# Altium project STM32F1_CNC_Project.PrjPcb
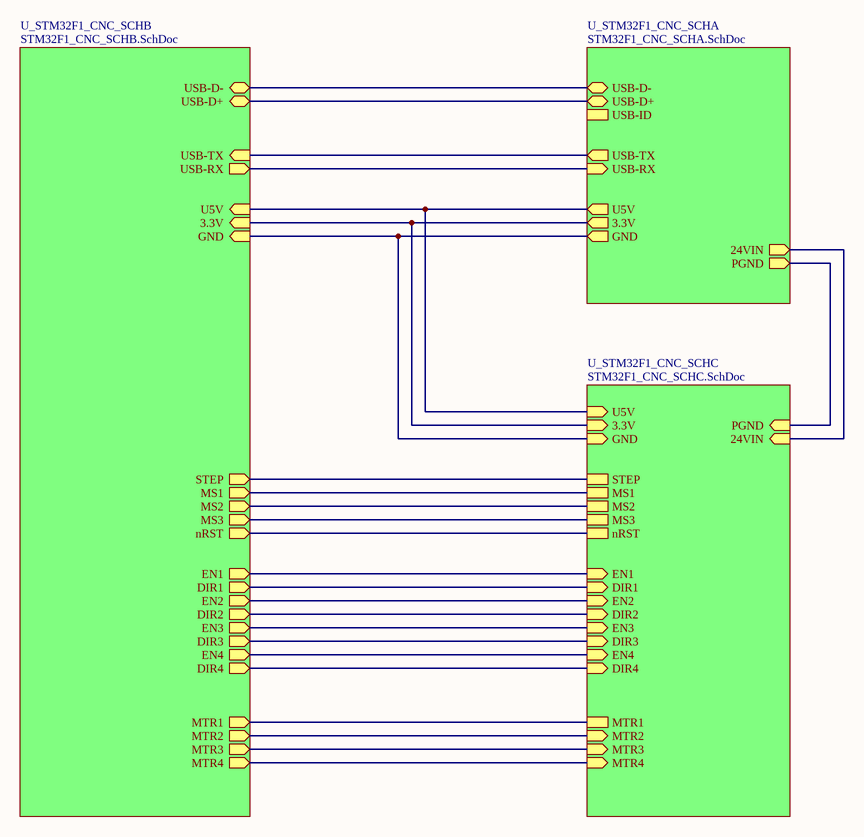
[diagram p0: STM32F1_CNC_SCH.SchDoc]
4 sheets, 120 parts. Net scope: hierarchical (ports join the sheet entries above them; power ports are global).
Board files: STM32F1_CNC_PCB.PcbDoc, CNC标志.PcbDoc
Sheets:
  STM32F1_CNC_SCH.SchDoc
    U_STM32F1_CNC_SCHA = STM32F1_CNC_SCHA.SchDoc
    U_STM32F1_CNC_SCHB = STM32F1_CNC_SCHB.SchDoc
    U_STM32F1_CNC_SCHC = STM32F1_CNC_SCHC.SchDoc

## Sheet STM32F1_CNC_SCH.SchDoc
size A4

### Sub-sheets
U_STM32F1_CNC_SCHA = STM32F1_CNC_SCHA.SchDoc: 24VIN (out), PGND (out), U5V (out), GND (out), USB-D- (bidir), USB-D+ (bidir), USB-ID, USB-TX (out), USB-RX (in), 3.3V (out)
U_STM32F1_CNC_SCHB = STM32F1_CNC_SCHB.SchDoc: GND (in), USB-D- (bidir), USB-D+ (bidir), USB-TX (in), USB-RX (out), 3.3V (in), U5V (in), STEP (out), MS1 (out), MS2 (out), MS3 (out), nRST (out), EN1 (out), DIR1 (out), EN2 (out), DIR2 (out), EN3 (out), DIR3 (out), EN4 (out), DIR4 (out), MTR1 (out), MTR2 (out), MTR3 (out), MTR4 (out)
U_STM32F1_CNC_SCHC = STM32F1_CNC_SCHC.SchDoc: 24VIN (in), PGND (in), U5V (in), GND (in), 3.3V (in), STEP, MS1, MS2, MS3, nRST, EN1 (in), DIR1 (in), EN2 (in), DIR2 (in), EN3 (in), DIR3 (in), EN4 (in), DIR4 (in), MTR1, MTR2 (in), MTR3 (in), MTR4 (in)

### Nets
3.3V: sheet U_STM32F1_CNC_SCHA/3.3V, sheet U_STM32F1_CNC_SCHB/3.3V, sheet U_STM32F1_CNC_SCHC/3.3V
24VIN: sheet U_STM32F1_CNC_SCHA/24VIN, sheet U_STM32F1_CNC_SCHC/24VIN
GND: sheet U_STM32F1_CNC_SCHA/PGND, sheet U_STM32F1_CNC_SCHA/GND, sheet U_STM32F1_CNC_SCHB/GND, sheet U_STM32F1_CNC_SCHC/PGND, sheet U_STM32F1_CNC_SCHC/GND
U5V: sheet U_STM32F1_CNC_SCHA/U5V, sheet U_STM32F1_CNC_SCHB/U5V, sheet U_STM32F1_CNC_SCHC/U5V
DIR1: sheet U_STM32F1_CNC_SCHB/DIR1, sheet U_STM32F1_CNC_SCHC/DIR1
DIR2: sheet U_STM32F1_CNC_SCHB/DIR2, sheet U_STM32F1_CNC_SCHC/DIR2
DIR3: sheet U_STM32F1_CNC_SCHB/DIR3, sheet U_STM32F1_CNC_SCHC/DIR3
DIR4: sheet U_STM32F1_CNC_SCHB/DIR4, sheet U_STM32F1_CNC_SCHC/DIR4
EN1: sheet U_STM32F1_CNC_SCHB/EN1, sheet U_STM32F1_CNC_SCHC/EN1
EN2: sheet U_STM32F1_CNC_SCHB/EN2, sheet U_STM32F1_CNC_SCHC/EN2
EN3: sheet U_STM32F1_CNC_SCHB/EN3, sheet U_STM32F1_CNC_SCHC/EN3
EN4: sheet U_STM32F1_CNC_SCHB/EN4, sheet U_STM32F1_CNC_SCHC/EN4
MS1: sheet U_STM32F1_CNC_SCHB/MS1, sheet U_STM32F1_CNC_SCHC/MS1
MS2: sheet U_STM32F1_CNC_SCHB/MS2, sheet U_STM32F1_CNC_SCHC/MS2
MS3: sheet U_STM32F1_CNC_SCHB/MS3, sheet U_STM32F1_CNC_SCHC/MS3
MTR1: sheet U_STM32F1_CNC_SCHB/MTR1, sheet U_STM32F1_CNC_SCHC/MTR1
MTR2: sheet U_STM32F1_CNC_SCHB/MTR2, sheet U_STM32F1_CNC_SCHC/MTR2
MTR3: sheet U_STM32F1_CNC_SCHB/MTR3, sheet U_STM32F1_CNC_SCHC/MTR3
MTR4: sheet U_STM32F1_CNC_SCHB/MTR4, sheet U_STM32F1_CNC_SCHC/MTR4
nRST: sheet U_STM32F1_CNC_SCHB/nRST, sheet U_STM32F1_CNC_SCHC/nRST
PA1_TIM2_CH2: sheet U_STM32F1_CNC_SCHB/STEP, sheet U_STM32F1_CNC_SCHC/STEP
PA9_USART1_TX: sheet U_STM32F1_CNC_SCHA/USB-RX, sheet U_STM32F1_CNC_SCHB/USB-RX
PA10_USART1_RX: sheet U_STM32F1_CNC_SCHA/USB-TX, sheet U_STM32F1_CNC_SCHB/USB-TX
PA11_USB_DM: sheet U_STM32F1_CNC_SCHA/USB-D-, sheet U_STM32F1_CNC_SCHB/USB-D-
PA12_USB_DP: sheet U_STM32F1_CNC_SCHA/USB-D+, sheet U_STM32F1_CNC_SCHB/USB-D+

## Sheet STM32F1_CNC_SCHA.SchDoc: STM32F1_CNC_POWER
size A4; Revision: 1.0; SheetNumber: 1
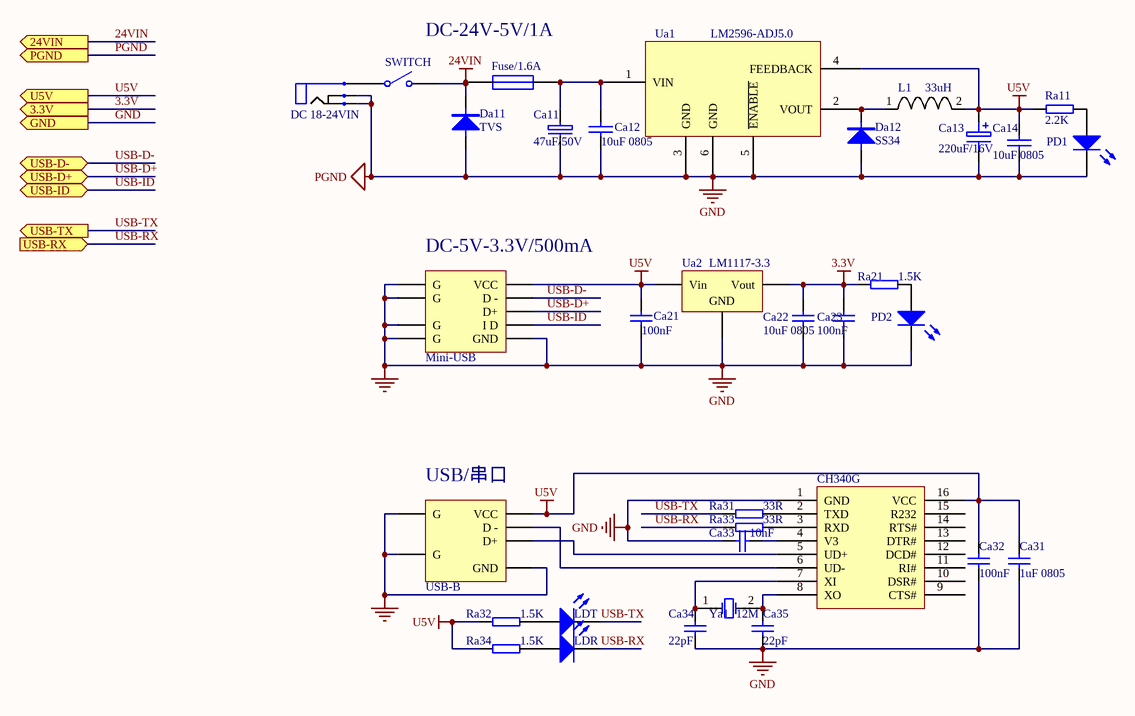
[diagram p1: STM32F1_CNC_SCHA.SchDoc]

### Parts
Ca11  47uF/50V  [SMD-EC-F6.3]
Ca12  10uF 0805  [0805]
Ca13  220uF/16V  [SMD-EC-F6.3]
Ca14  10uF 0805  [0805]
Ca21  100nF  [0805]
Ca22  10uF 0805  [0805]
Ca23  100nF  [0603]
Ca31  1uF 0805  [0805]
Ca32  100nF  [0603]
Ca33  10nF  [0603]
Ca34  22pF  [0603]
Ca35  22pF  [0603]
CH340G  CH340G  [SO-16]  (value not drawn)
Da11  TVS  [SMA]
Da12  SS34  [SMA]
DC_18-24VIN  DC  [DC-9V]  (value not drawn)
Fuse/1.6A  Fuse  [1812]  (value not drawn)
L1  33uH  [L]
LDR  LED  [LED-0805]  (value not drawn)
LDT  LED  [LED-0805]  (value not drawn)
Mini-USB  Mini-USB  [USB-mini-S]  (value not drawn)
PD1  LED  [LED-0805]  (value not drawn)
PD2  LED  [LED-0805]  (value not drawn)
Ra11  2.2K  [0805]
Ra21  1.5K  [0603]
Ra31  33R  [0603]
Ra32  1.5K  [0603]
Ra33  33R  [0603]
Ra34  1.5K  [0603]
SWITCH  SW-SPST  [SWTCH]  (value not drawn)
Ua1  LM2596-ADJ5.0  [LM2596S]
Ua2  LM1117-3.3  [SOT223]
USB-B  USB-B  [USB-B2]  (value not drawn)
Ya1  12M  [XTAL-3215-2P]

### Ports
3.3V (out), 24VIN (out), GND (out), PGND (out), U5V (out), USB-D+ (bidir), USB-D- (bidir), USB-ID (bidir), USB-RX (in), USB-TX (out)

### Nets
3.3V: Ca22.1 Ca23.2 Ra21.2 Ua2.2(Vout) ; port 3.3V
24VIN: Da11.2 Fuse/1.6A.1 SWITCH.1(NO) ; port 24VIN
GND: Ca11.2 Ca12.2 Ca13.2 Ca14.2 Ca21.1 Ca22.2 Ca23.1 Ca31.2 Ca32.2 Ca33.2 Ca34.1 Ca35.1 CH340G.1(GND) Da11.1 Da12.1 DC_18-24VIN.2 DC_18-24VIN.3 Mini-USB.0(G) Mini-USB.5(GND) PD1.2(K) PD2.2(K) Ua1.3(GND) Ua1.5(~{ENABLE}) Ua1.6(GND) Ua2.1(GND) USB-B.0(G) USB-B.4(GND) ; port PGND, port GND  [also labelled PGND]
U5V: Ca13.1 Ca14.1 Ca21.2 Ca31.1 Ca32.1 CH340G.16(VCC) L1.2 Mini-USB.1(VCC) Ra11.2 Ra32.2 Ra34.2 Ua1.4(FEEDBACK) Ua2.3(Vin) USB-B.1(VCC) ; port U5V
USB-D+: Mini-USB.3(D+) ; port USB-D+  [project net PA12_USB_DP]
USB-D-: Mini-USB.2(D_-) ; port USB-D-  [project net PA11_USB_DM]
USB-ID: Mini-USB.4(I_D) ; port USB-ID
USB-RX: LDR.2(K) Ra33.2 ; port USB-RX  [project net PA9_USART1_TX]
USB-TX: LDT.2(K) Ra31.2 ; port USB-TX  [project net PA10_USART1_RX]
NetCa11_1: Ca11.1 Ca12.1 Fuse/1.6A.2 Ua1.1(VIN)
NetCa33_1: Ca33.1 CH340G.4(V3)
NetCa34_2: Ca34.2 CH340G.7(XI) Ya1.1(OSC1)
NetCa35_2: Ca35.2 CH340G.8(XO) Ya1.2(OSC2)
NetCH340G_2: CH340G.2(TXD) Ra31.1
NetCH340G_3: CH340G.3(RXD) Ra33.1
NetCH340G_5: CH340G.5(UD+) USB-B.3(D+)
NetCH340G_6: CH340G.6(UD-) USB-B.2(D_-)
NetDa12_2: Da12.2 L1.1 Ua1.2(VOUT)
NetDC_18-24VIN_1: DC_18-24VIN.1 SWITCH.2(COMMON)
NetLDR_1: LDR.1(A) Ra34.1
NetLDT_1: LDT.1(A) Ra32.1
NetPD1_1: PD1.1(A) Ra11.1
NetPD2_1: PD2.1(A) Ra21.1

Not connected (* = marked no-connect by the designer): CH340G 9(CTS#) 10(DSR#) 11(RI#) 12(DCD#) 13(DTR#) 14(RTS#) 15(R232)

### Notes on the sheet
- DC-24V-5V/1A
- (near Mini-USB) DC-5V-3.3V/500mA
- (near USB-B) USB/串口

### Library data of the parts
Ca11 = EC1: Electro Capacitor
Ca12 Ca14 = CAP: Capacitor
Ca13 = ELECTR
Ca21 = CAP SMD 0603  X5R 1礔 25V 10%: 0603  X5R; Value: 1礔; Rated voltage: 25V; Tolerance: 10%; Manufacturer: *; Manufacturer P/N: *; Order code Farnell: 1288202RL; Power: *; Technology: X5R; Temperature  Factor: *; Temperature Max: +125癈; Temperature Min: -55癈; STS Code: *
Ca22 = CAP SMD 0603  X5R 1礔 25V 10%: 0603  X5R 1礔; Rated voltage: 25V; Tolerance: 10%; Manufacturer: *; Manufacturer P/N: *; Order code Farnell: 1288202RL; Value: 1礔; Power: *; Technology: X5R; Temperature  Factor: *; Temperature Max: +125癈; Temperature Min: -55癈; STS Code: *
Ca23 = Capacitor_ST: Capacitor 0402 / 0603 / 0805; Revision: July-2002: Re-released for DXP Platform.; Value: 100nF
Ca31-Ca35 = Cap: Capacitor; Published: 8-Jun-2000; LatestRevisionDate: 17-Jul-2002; LatestRevisionNote: Re-released for DXP Platform.; PackageReference: RAD-0.3; Publisher: Altium Limited; PackageDescription: Radial Cap, Thru-Hole; 2 Leads; 0.3 in Pin Spacing
  Ca31: Value: 1uF
  Ca32: Value: 100nF
  Ca33: Value: 10nF
  Ca34 Ca35: Value: 22pF
CH340G = Component_1
Da11 = DIODE: Low-Loss RF Switching Diode
Da12 = DIODE: D; value: ZM4733/5.1V,1W
DC_18-24VIN = DC-5.5mm
L1 = L
LDR LDT PD1 PD2 = LED2: Typical RED, GREEN, YELLOW, AMBER GaAs LED; Published: 8-Jun-2000; LatestRevisionDate: 17-Jul-2002; LatestRevisionNote: Re-released for DXP Platform.; PackageVersion: Feb-2002; PackageReference: 3.2X1.6X1.1; Publisher: Altium Limited; PackageDescription: SM LED; 2 Flat Leads
Mini-USB USB-B = Mini-USB_G
Ra11 Ra21 Ra31-Ra34 = RES1: Resister
SWITCH = SW-SPST: Single-Pole, Single-Throw Switch; Published: 24-Mar-1999; LatestRevisionDate: 17-Jul-2002; LatestRevisionNote: Re-released for DXP Platform.; PackageReference: SPST-2; Publisher: Altium Limited; PackageDescription: Switch; 2 Leads
Ua1 = LM2575
Ua2 = Volt Reg: Voltage Regulator; Published: 24-Mar-1999; LatestRevisionDate: 29-May-2009; LatestRevisionNote: IPC-7351 Footprint Added.; PackageReference: D2PAK; Publisher: Altium Limited; PackageDescription: 3-Pin Transistor Outline Package 2.54 mm Pitch, 15.1 mm Lead Span
Ya1 = XTAL: Crystal Oscillator; Published: 8-Jun-2000; LatestRevisionDate: 17-Jul-2002; LatestRevisionNote: Re-released for DXP Platform.; PackageReference: R38; Publisher: Altium Limited; PackageDescription: Crystal, Thru-Hole; 2 Leads; Body 3.1 x 8.2 mm (Dia.xH)

## Sheet STM32F1_CNC_SCHB.SchDoc
size A4
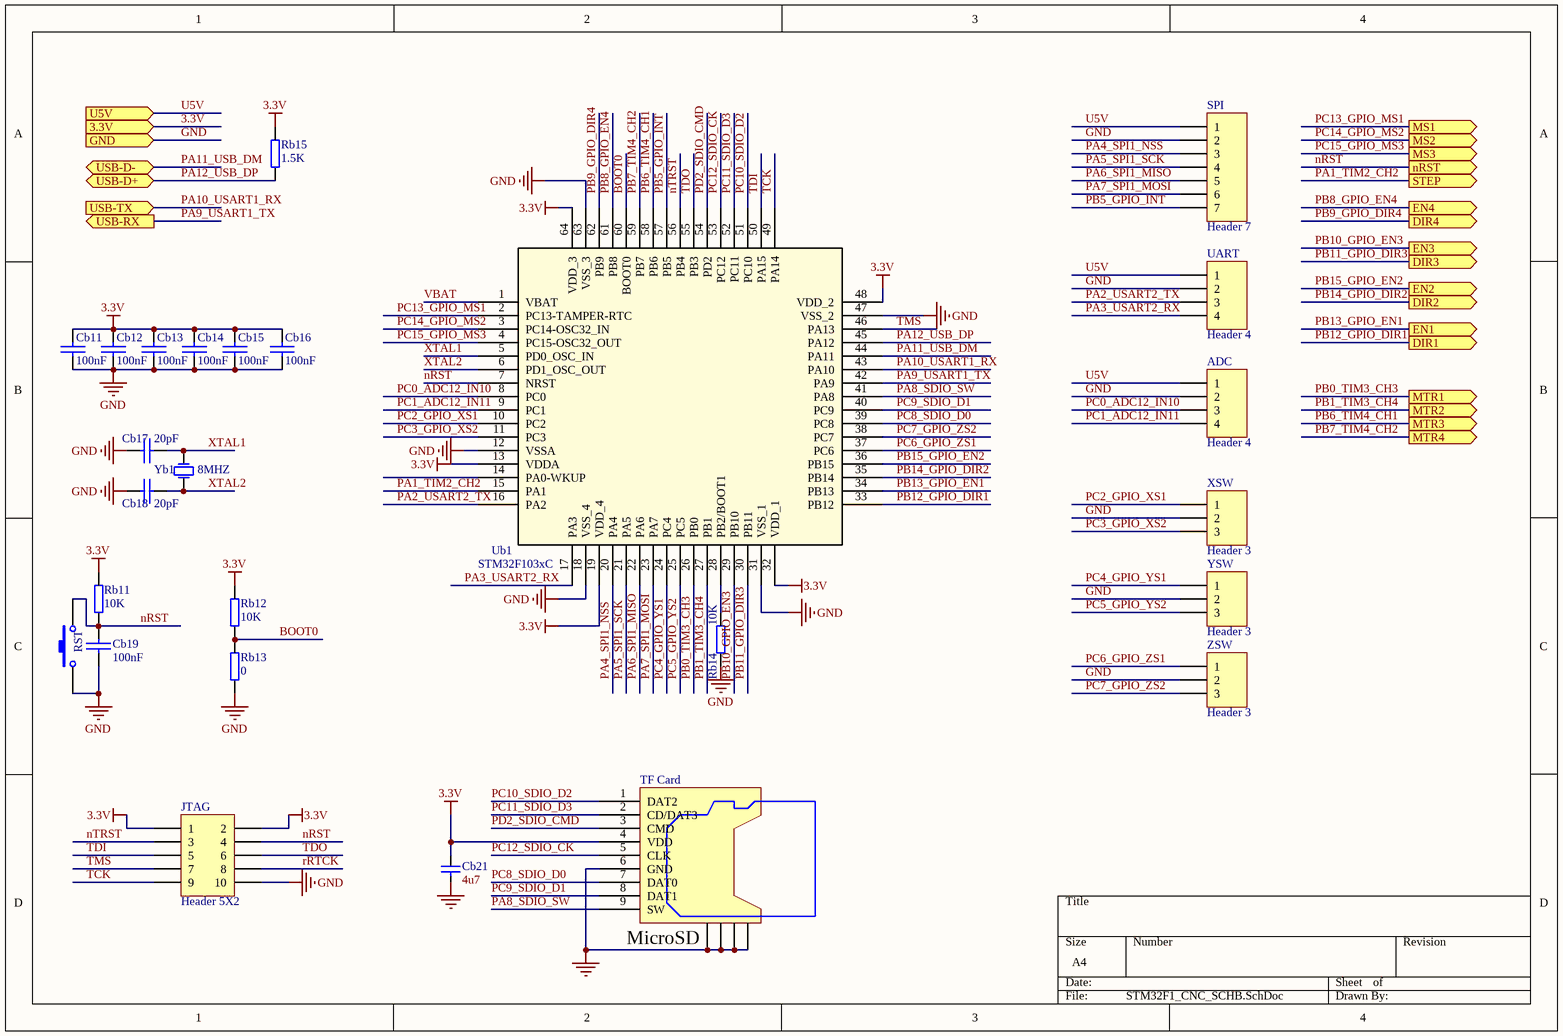
[diagram p2: STM32F1_CNC_SCHB.SchDoc]

### Parts
ADC  Header 4  [HDR-2.54-4P]
Cb11  100nF  [0603]
Cb12  100nF  [0603]
Cb13  100nF  [0603]
Cb14  100nF  [0603]
Cb15  100nF  [0603]
Cb16  100nF  [0603]
Cb17  20pF  [0603]
Cb18  20pF  [0603]
Cb19  100nF  [0603]
Cb21  4u7  [0603]
JTAG  Header 5X2  [IDC10P-2.54]
Rb11  10K  [0603]
Rb12  10K  [0603]
Rb13  0  [0603]
Rb14  10K  [0603]
Rb15  1.5K  [0603]
RST  SW-PB  [RST-6*6]  (value not drawn)
SPI  Header 7  [HDR-2.54-7P]
TF_Card  microSD PUSH-PULL  [TF Card]  (value not drawn)
UART  Header 4  [HDR-2.54-4P]
Ub1  STM32F103xC  [QFP64]
XSW  Header 3  [HDR-2.54-3P]
Yb1  8MHZ  [XTAL-3215-2P]
YSW  Header 3  [HDR-2.54-3P]
ZSW  Header 3  [HDR-2.54-3P]

### Ports
3.3V (in), DIR1 (out), DIR2 (out), DIR3 (out), DIR4 (out), EN1 (out), EN2 (out), EN3 (out), EN4 (out), GND (in), MS1 (out), MS2 (out), MS3 (out), MTR1 (out), MTR2 (out), MTR3 (out), MTR4 (out), nRST (out), STEP (out), U5V (in), USB-D+ (bidir), USB-D- (bidir), USB-RX (out), USB-TX (in)

### Nets
3.3V: Cb11.1 Cb12.1 Cb13.1 Cb14.1 Cb15.1 Cb16.1 Cb21.2 JTAG.1 JTAG.2 Rb11.1 Rb12.1 Rb15.1 TF_Card.4(VDD) Ub1.13(VDDA) Ub1.19(VDD_4) Ub1.32(VDD_1) Ub1.48(VDD_2) Ub1.64(VDD_3) ; port 3.3V
GND: ADC.2 Cb11.2 Cb12.2 Cb13.2 Cb14.2 Cb15.2 Cb16.2 Cb17.1 Cb18.1 Cb19.2 Cb21.1 JTAG.10 Rb13.2 Rb14.2 RST.2 SPI.2 TF_Card.6(GND) TF_Card.GP1 TF_Card.GP2 TF_Card.GP3 TF_Card.GP4 UART.2 Ub1.12(VSSA) Ub1.18(VSS_4) Ub1.31(VSS_1) Ub1.47(VSS_2) Ub1.63(VSS_3) XSW.2 YSW.2 ZSW.2 ; port GND
U5V: ADC.1 SPI.1 UART.1 ; port U5V
BOOT0: Rb12.2 Rb13.1 Ub1.60(BOOT0)
nRST: Cb19.1 JTAG.4 Rb11.2 RST.1 Ub1.7(NRST) ; port nRST
nTRST: JTAG.3 Ub1.56(PB4)
PA1_TIM2_CH2: Ub1.15(PA1) ; port STEP
PA2_USART2_TX: UART.3 Ub1.16(PA2)
PA3_USART2_RX: UART.4 Ub1.17(PA3)
PA4_SPI1_NSS: SPI.3 Ub1.20(PA4)
PA5_SPI1_SCK: SPI.4 Ub1.21(PA5)
PA6_SPI1_MISO: SPI.5 Ub1.22(PA6)
PA7_SPI1_MOSI: SPI.6 Ub1.23(PA7)
PA8_SDIO_SW: TF_Card.9(SW) Ub1.41(PA8)
PA9_USART1_TX: Ub1.42(PA9) ; port USB-RX
PA10_USART1_RX: Ub1.43(PA10) ; port USB-TX
PA11_USB_DM: Ub1.44(PA11) ; port USB-D-
PA12_USB_DP: Rb15.2 Ub1.45(PA12) ; port USB-D+
PB0_TIM3_CH3: Ub1.26(PB0) ; port MTR1  [project net MTR1]
PB1_TIM3_CH4: Ub1.27(PB1) ; port MTR2  [project net MTR2]
PB5_GPIO_INT: SPI.7 Ub1.57(PB5)
PB6_TIM4_CH1: Ub1.58(PB6) ; port MTR3  [project net MTR3]
PB7_TIM4_CH2: Ub1.59(PB7) ; port MTR4  [project net MTR4]
PB8_GPIO_EN4: Ub1.61(PB8) ; port EN4  [project net EN4]
PB9_GPIO_DIR4: Ub1.62(PB9) ; port DIR4  [project net DIR4]
PB10_GPIO_EN3: Ub1.29(PB10) ; port EN3  [project net EN3]
PB11_GPIO_DIR3: Ub1.30(PB11) ; port DIR3  [project net DIR3]
PB12_GPIO_DIR1: Ub1.33(PB12) ; port DIR1  [project net DIR1]
PB13_GPIO_EN1: Ub1.34(PB13) ; port EN1  [project net EN1]
PB14_GPIO_DIR2: Ub1.35(PB14) ; port DIR2  [project net DIR2]
PB15_GPIO_EN2: Ub1.36(PB15) ; port EN2  [project net EN2]
PC0_ADC12_IN10: ADC.3 Ub1.8(PC0)
PC1_ADC12_IN11: ADC.4 Ub1.9(PC1)
PC2_GPIO_XS1: Ub1.10(PC2) XSW.1
PC3_GPIO_XS2: Ub1.11(PC3) XSW.3
PC4_GPIO_YS1: Ub1.24(PC4) YSW.1
PC5_GPIO_YS2: Ub1.25(PC5) YSW.3
PC6_GPIO_ZS1: Ub1.37(PC6) ZSW.1
PC7_GPIO_ZS2: Ub1.38(PC7) ZSW.3
PC8_SDIO_D0: TF_Card.7(DAT0) Ub1.39(PC8)
PC9_SDIO_D1: TF_Card.8(DAT1) Ub1.40(PC9)
PC10_SDIO_D2: TF_Card.1(DAT2) Ub1.51(PC10)
PC11_SDIO_D3: TF_Card.2(CD/DAT3) Ub1.52(PC11)
PC12_SDIO_CK: TF_Card.5(CLK) Ub1.53(PC12)
PC13_GPIO_MS1: Ub1.2(PC13-TAMPER-RTC) ; port MS1  [project net MS1]
PC14_GPIO_MS2: Ub1.3(PC14-OSC32_IN) ; port MS2  [project net MS2]
PC15_GPIO_MS3: Ub1.4(PC15-OSC32_OUT) ; port MS3  [project net MS3]
PD2_SDIO_CMD: TF_Card.3(CMD) Ub1.54(PD2)
rRTCK: JTAG.8
TCK: JTAG.9 Ub1.49(PA14)
TDI: JTAG.5 Ub1.50(PA15)
TDO: JTAG.6 Ub1.55(PB3)
TMS: JTAG.7 Ub1.46(PA13)
VBAT: Ub1.1(VBAT)
XTAL1: Cb17.2 Ub1.5(PD0_OSC_IN) Yb1.2(OSC2)
XTAL2: Cb18.2 Ub1.6(PD1_OSC_OUT) Yb1.1(OSC1)
NetRb14_1: Rb14.1 Ub1.28(PB2/BOOT1)

Not connected (* = marked no-connect by the designer): Ub1 14(PA0-WKUP)

### Notes on the sheet
- (near TF_Card) MicroSD

### Library data of the parts
ADC UART = Header 4: Header, 4-Pin; LatestRevisionDate: 17-Jul-2002; LatestRevisionNote: Re-released for DXP Platform.; Publisher: Altium Limited
Cb11-Cb19 = CAP: Capacitor
  Cb11-Cb16 Cb19: value: 100nF
  Cb17 Cb18: value: 20pF
Cb21 = Cap
JTAG = Header 5X2: Header, 5-Pin, Dual row; LatestRevisionDate: 17-Jul-2002; LatestRevisionNote: Re-released for DXP Platform.; Publisher: Altium Limited
Rb11-Rb15 = RES1: Resister
  Rb11: value: 10K
  Rb15: value: 1.5K
RST = SW-PB: Switch; Published: 24-Mar-1999; LatestRevisionDate: 17-Jul-2002; LatestRevisionNote: Re-released for DXP Platform.; PackageReference: SPST-2; Publisher: Altium Limited; PackageDescription: Switch; 2 Leads
SPI = Header 7: Header, 7-Pin; LatestRevisionDate: 17-Jul-2002; LatestRevisionNote: Re-released for DXP Platform.; Publisher: Altium Limited
XSW YSW ZSW = Header 3: Header, 3-Pin; LatestRevisionDate: 17-Jul-2002; LatestRevisionNote: Re-released for DXP Platform.; Publisher: Altium Limited
Yb1 = ECS-10-13-1: Crystal Oscillator; Published: 17-Jul-2002; Datasheet: Latest Revision: 18-Apr-2000; Publisher: Altium Limited

## Sheet STM32F1_CNC_SCHC.SchDoc
size A4
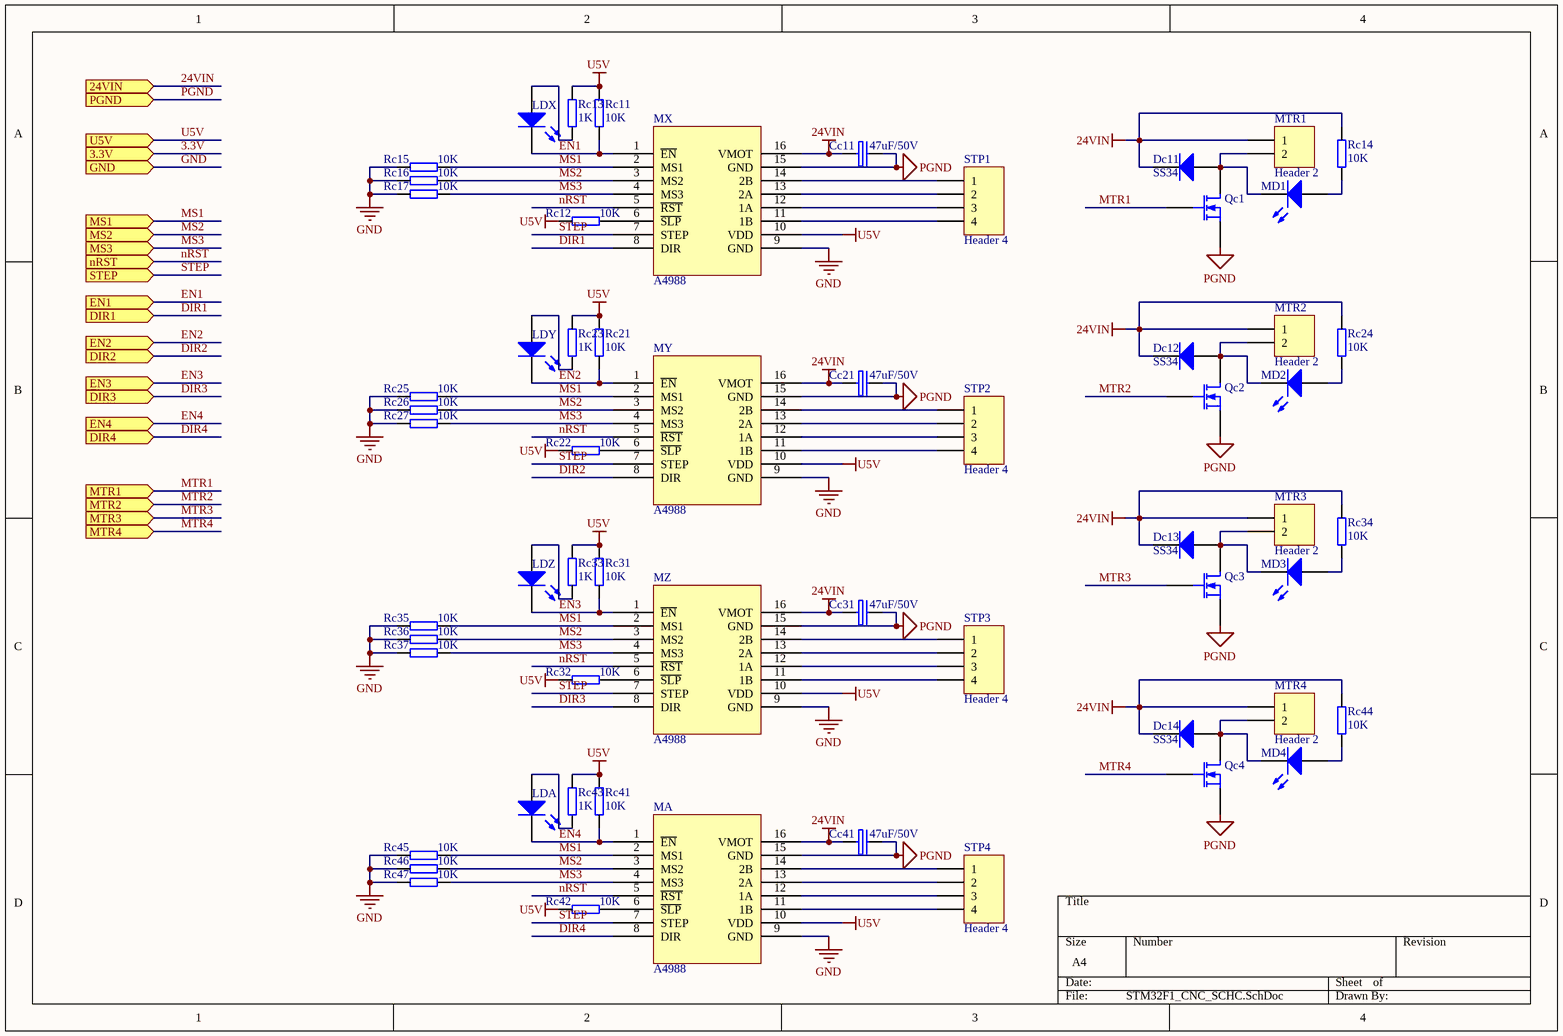
[diagram p3: STM32F1_CNC_SCHC.SchDoc]

### Parts
Cc11  47uF/50V  [SMD-EC-F6.3]
Cc21  47uF/50V  [SMD-EC-F6.3]
Cc31  47uF/50V  [SMD-EC-F6.3]
Cc41  47uF/50V  [SMD-EC-F6.3]
Dc11  SS34  [SMA]
Dc12  SS34  [SMA]
Dc13  SS34  [SMA]
Dc14  SS34  [SMA]
LDA  LED  [LED-0805]  (value not drawn)
LDX  LED  [LED-0805]  (value not drawn)
LDY  LED  [LED-0805]  (value not drawn)
LDZ  LED  [LED-0805]  (value not drawn)
MA  A4988  [A4988]
MD1  LED  [LED-0805]  (value not drawn)
MD2  LED  [LED-0805]  (value not drawn)
MD3  LED  [LED-0805]  (value not drawn)
MD4  LED  [LED-0805]  (value not drawn)
MTR1  Header 2  [DG1282-5.0]
MTR2  Header 2  [DG1282-5.0]
MTR3  Header 2  [DG1282-5.0]
MTR4  Header 2  [DG1282-5.0]
MX  A4988  [A4988]
MY  A4988  [A4988]
MZ  A4988  [A4988]
Qc1  MOSFET-N  [LR7843]  (value not drawn)
Qc2  MOSFET-N  [LR7843]  (value not drawn)
Qc3  MOSFET-N  [LR7843]  (value not drawn)
Qc4  MOSFET-N  [LR7843]  (value not drawn)
Rc11  10K  [0603]
Rc12  10K  [0603]
Rc13  1K  [0603]
Rc14  10K  [0603]
Rc15  10K  [0603]
Rc16  10K  [0603]
Rc17  10K  [0603]
Rc21  10K  [0603]
Rc22  10K  [0603]
Rc23  1K  [0603]
Rc24  10K  [0603]
Rc25  10K  [0603]
Rc26  10K  [0603]
Rc27  10K  [0603]
Rc31  10K  [0603]
Rc32  10K  [0603]
Rc33  1K  [0603]
Rc34  10K  [0603]
Rc35  10K  [0603]
Rc36  10K  [0603]
Rc37  10K  [0603]
Rc41  10K  [0603]
Rc42  10K  [0603]
Rc43  1K  [0603]
Rc44  10K  [0603]
Rc45  10K  [0603]
Rc46  10K  [0603]
Rc47  10K  [0603]
STP1  Header 4  [HDR-2.54-4P]
STP2  Header 4  [HDR-2.54-4P]
STP3  Header 4  [HDR-2.54-4P]
STP4  Header 4  [HDR-2.54-4P]

### Ports
3.3V (in), 24VIN (in), DIR1 (in), DIR2 (in), DIR3 (in), DIR4 (in), EN1 (in), EN2 (in), EN3 (in), EN4 (in), GND (in), MS1 (in), MS2 (in), MS3 (in), MTR1 (in), MTR2 (in), MTR3 (in), MTR4 (in), nRST (in), PGND (in), STEP (in), U5V (in)

### Nets
24VIN: Cc11.1 Cc21.1 Cc31.1 Cc41.1 Dc11.2(K) Dc12.2(K) Dc13.2(K) Dc14.2(K) MA.16(VMOT) MTR1.1 MTR2.1 MTR3.1 MTR4.1 MX.16(VMOT) MY.16(VMOT) MZ.16(VMOT) Rc14.1 Rc24.1 Rc34.1 Rc44.1 ; port 24VIN
GND: Cc11.2 Cc21.2 Cc31.2 Cc41.2 MA.9(GND) MA.15(GND) MX.9(GND) MX.15(GND) MY.9(GND) MY.15(GND) MZ.9(GND) MZ.15(GND) Qc1.3(S) Qc2.3(S) Qc3.3(S) Qc4.3(S) Rc15.1 Rc16.1 Rc17.1 Rc25.1 Rc26.1 Rc27.1 Rc35.1 Rc36.1 Rc37.1 Rc45.1 Rc46.1 Rc47.1 ; port PGND, port GND  [also labelled PGND]
U5V: MA.10(VDD) MX.10(VDD) MY.10(VDD) MZ.10(VDD) Rc11.2 Rc12.1 Rc13.1 Rc21.2 Rc22.1 Rc23.1 Rc31.2 Rc32.1 Rc33.2 Rc41.2 Rc42.1 Rc43.1 ; port U5V
DIR1: MX.8(DIR) ; port DIR1
DIR2: MY.8(DIR) ; port DIR2
DIR3: MZ.8(DIR) ; port DIR3
DIR4: MA.8(DIR) ; port DIR4
EN1: LDX.2(K) MX.1(~{EN}) Rc11.1 ; port EN1
EN2: LDY.2(K) MY.1(~{EN}) Rc21.1 ; port EN2
EN3: LDZ.2(K) MZ.1(~{EN}) Rc31.1 ; port EN3
EN4: LDA.2(K) MA.1(~{EN}) Rc41.1 ; port EN4
MS1: MA.2(MS1) MX.2(MS1) MY.2(MS1) MZ.2(MS1) Rc15.2 Rc25.2 Rc35.2 Rc45.2 ; port MS1
MS2: MA.3(MS2) MX.3(MS2) MY.3(MS2) MZ.3(MS2) Rc16.2 Rc26.2 Rc36.2 Rc46.2 ; port MS2
MS3: MA.4(MS3) MX.4(MS3) MY.4(MS3) MZ.4(MS3) Rc17.2 Rc27.2 Rc37.2 Rc47.2 ; port MS3
MTR1: Qc1.1(G) ; port MTR1
MTR2: Qc2.1(G) ; port MTR2
MTR3: Qc3.1(G) ; port MTR3
MTR4: Qc4.1(G) ; port MTR4
nRST: MA.5(~{RST}) MX.5(~{RST}) MY.5(~{RST}) MZ.5(~{RST}) ; port nRST
STEP: MA.7(STEP) MX.7(STEP) MY.7(STEP) MZ.7(STEP) ; port STEP  [project net PA1_TIM2_CH2]
NetDc11_1: Dc11.1(A) MD1.2(K) MTR1.2 Qc1.2(D)
NetDc12_1: Dc12.1(A) MD2.2(K) MTR2.2 Qc2.2(D)
NetDc13_1: Dc13.1(A) MD3.2(K) MTR3.2 Qc3.2(D)
NetDc14_1: Dc14.1(A) MD4.2(K) MTR4.2 Qc4.2(D)
NetLDA_1: LDA.1(A) Rc43.2
NetLDX_1: LDX.1(A) Rc13.2
NetLDY_1: LDY.1(A) Rc23.2
NetLDZ_1: LDZ.1(A) Rc33.1
NetMA_6: MA.6(~{SLP}) Rc42.2
NetMA_11: MA.11(1B) STP4.4
NetMA_12: MA.12(1A) STP4.3
NetMA_13: MA.13(2A) STP4.2
NetMA_14: MA.14(2B) STP4.1
NetMD1_1: MD1.1(A) Rc14.2
NetMD2_1: MD2.1(A) Rc24.2
NetMD3_1: MD3.1(A) Rc34.2
NetMD4_1: MD4.1(A) Rc44.2
NetMX_6: MX.6(~{SLP}) Rc12.2
NetMX_11: MX.11(1B) STP1.4
NetMX_12: MX.12(1A) STP1.3
NetMX_13: MX.13(2A) STP1.2
NetMX_14: MX.14(2B) STP1.1
NetMY_6: MY.6(~{SLP}) Rc22.2
NetMY_11: MY.11(1B) STP2.4
NetMY_12: MY.12(1A) STP2.3
NetMY_13: MY.13(2A) STP2.2
NetMY_14: MY.14(2B) STP2.1
NetMZ_6: MZ.6(~{SLP}) Rc32.2
NetMZ_11: MZ.11(1B) STP3.4
NetMZ_12: MZ.12(1A) STP3.3
NetMZ_13: MZ.13(2A) STP3.2
NetMZ_14: MZ.14(2B) STP3.1

### Library data of the parts
Cc11 Cc21 Cc31 Cc41 = EC1: Electro Capacitor
Dc11-Dc14 = Diode BAT18: Low-Loss RF Switching Diode; Note: Pin 2 is not connected and not drawn.; Published: 21-Mar-2003; LatestRevisionDate: 29-May-2009; LatestRevisionNote: IPC-7351 Footprint Added.; DatasheetVersion: Oct-1999; PackageVersion: Sep-2001; PackageReference: SOT-23; Publisher: Altium Limited; PackageDescription: 3-Pin SOT-23 Package 0.95 mm Pitch, 2.5 mm Lead Span; ComponentLink1Description: Manufacturer Link; ComponentLink1URL: http://www.infineon.com/
LDA LDX LDY LDZ MD1-MD4 = LED2: as LDR on sheet STM32F1_CNC_SCHA; Published: 8-Jun-2000; LatestRevisionDate: 17-Jul-2002; LatestRevisionNote: Re-released for DXP Platform.; PackageVersion: Feb-2002; PackageReference: 3.2X1.6X1.1; Publisher: Altium Limited; PackageDescription: SM LED; 2 Flat Leads
MTR1-MTR4 = Header 2: Header, 2-Pin; LatestRevisionDate: 17-Jul-2002; LatestRevisionNote: Re-released for DXP Platform.; Publisher: Altium Limited
Qc1-Qc4 = MOSFET-N: N-Channel MOSFET; Published: 8-Jun-2000; LatestRevisionDate: 17-Jul-2002; LatestRevisionNote: Re-released for DXP Platform.; PackageVersion: 1995/1996; PackageReference: E3; Publisher: Altium Limited; PackageDescription: TO, Flat Index; 3 In-Line, Axial Leads; Body Dia. 4.6mm; Lead Dia. 0.5 mm (max)
Rc11-Rc17 Rc21-Rc27 Rc31-Rc37 Rc41-Rc47 = RES1: Resister
  Rc11 Rc12 Rc15-Rc17 Rc21 Rc22 Rc25-Rc27 Rc31 Rc32 Rc35-Rc37 Rc41 Rc42 Rc45-Rc47: value: 10K
STP1-STP4 = Header 4: Header, 4-Pin; LatestRevisionDate: 17-Jul-2002; LatestRevisionNote: Re-released for DXP Platform.; Publisher: Altium Limited

## Nets that join several sheets
3.3V: STM32F1_CNC_SCHA (Ca22.1 Ca23.2 Ra21.2 Ua2.2), STM32F1_CNC_SCHB (18 pins)
24VIN: STM32F1_CNC_SCHA (Da11.2 Fuse/1.6A.1 SWITCH.1), STM32F1_CNC_SCHC (20 pins)
GND: STM32F1_CNC_SCHA (27 pins), STM32F1_CNC_SCHB (30 pins), STM32F1_CNC_SCHC (28 pins)
U5V: STM32F1_CNC_SCHA (14 pins), STM32F1_CNC_SCHB (ADC.1 SPI.1 UART.1), STM32F1_CNC_SCHC (16 pins)
DIR1: STM32F1_CNC_SCHB (Ub1.33), STM32F1_CNC_SCHC (MX.8)
DIR2: STM32F1_CNC_SCHB (Ub1.35), STM32F1_CNC_SCHC (MY.8)
DIR3: STM32F1_CNC_SCHB (Ub1.30), STM32F1_CNC_SCHC (MZ.8)
DIR4: STM32F1_CNC_SCHB (Ub1.62), STM32F1_CNC_SCHC (MA.8)
EN1: STM32F1_CNC_SCHB (Ub1.34), STM32F1_CNC_SCHC (LDX.2 MX.1 Rc11.1)
EN2: STM32F1_CNC_SCHB (Ub1.36), STM32F1_CNC_SCHC (LDY.2 MY.1 Rc21.1)
EN3: STM32F1_CNC_SCHB (Ub1.29), STM32F1_CNC_SCHC (LDZ.2 MZ.1 Rc31.1)
EN4: STM32F1_CNC_SCHB (Ub1.61), STM32F1_CNC_SCHC (LDA.2 MA.1 Rc41.1)
MS1: STM32F1_CNC_SCHB (Ub1.2), STM32F1_CNC_SCHC (8 pins)
MS2: STM32F1_CNC_SCHB (Ub1.3), STM32F1_CNC_SCHC (8 pins)
MS3: STM32F1_CNC_SCHB (Ub1.4), STM32F1_CNC_SCHC (8 pins)
MTR1: STM32F1_CNC_SCHB (Ub1.26), STM32F1_CNC_SCHC (Qc1.1)
MTR2: STM32F1_CNC_SCHB (Ub1.27), STM32F1_CNC_SCHC (Qc2.1)
MTR3: STM32F1_CNC_SCHB (Ub1.58), STM32F1_CNC_SCHC (Qc3.1)
MTR4: STM32F1_CNC_SCHB (Ub1.59), STM32F1_CNC_SCHC (Qc4.1)
nRST: STM32F1_CNC_SCHB (5 pins), STM32F1_CNC_SCHC (MA.5 MX.5 MY.5 MZ.5)
PA1_TIM2_CH2: STM32F1_CNC_SCHB (Ub1.15), STM32F1_CNC_SCHC (MA.7 MX.7 MY.7 MZ.7)
PA9_USART1_TX: STM32F1_CNC_SCHA (LDR.2 Ra33.2), STM32F1_CNC_SCHB (Ub1.42)
PA10_USART1_RX: STM32F1_CNC_SCHA (LDT.2 Ra31.2), STM32F1_CNC_SCHB (Ub1.43)
PA11_USB_DM: STM32F1_CNC_SCHA (Mini-USB.2), STM32F1_CNC_SCHB (Ub1.44)
PA12_USB_DP: STM32F1_CNC_SCHA (Mini-USB.3), STM32F1_CNC_SCHB (Rb15.2 Ub1.45)